# EAGLE schematic Schematic (EAGLE 6.3)
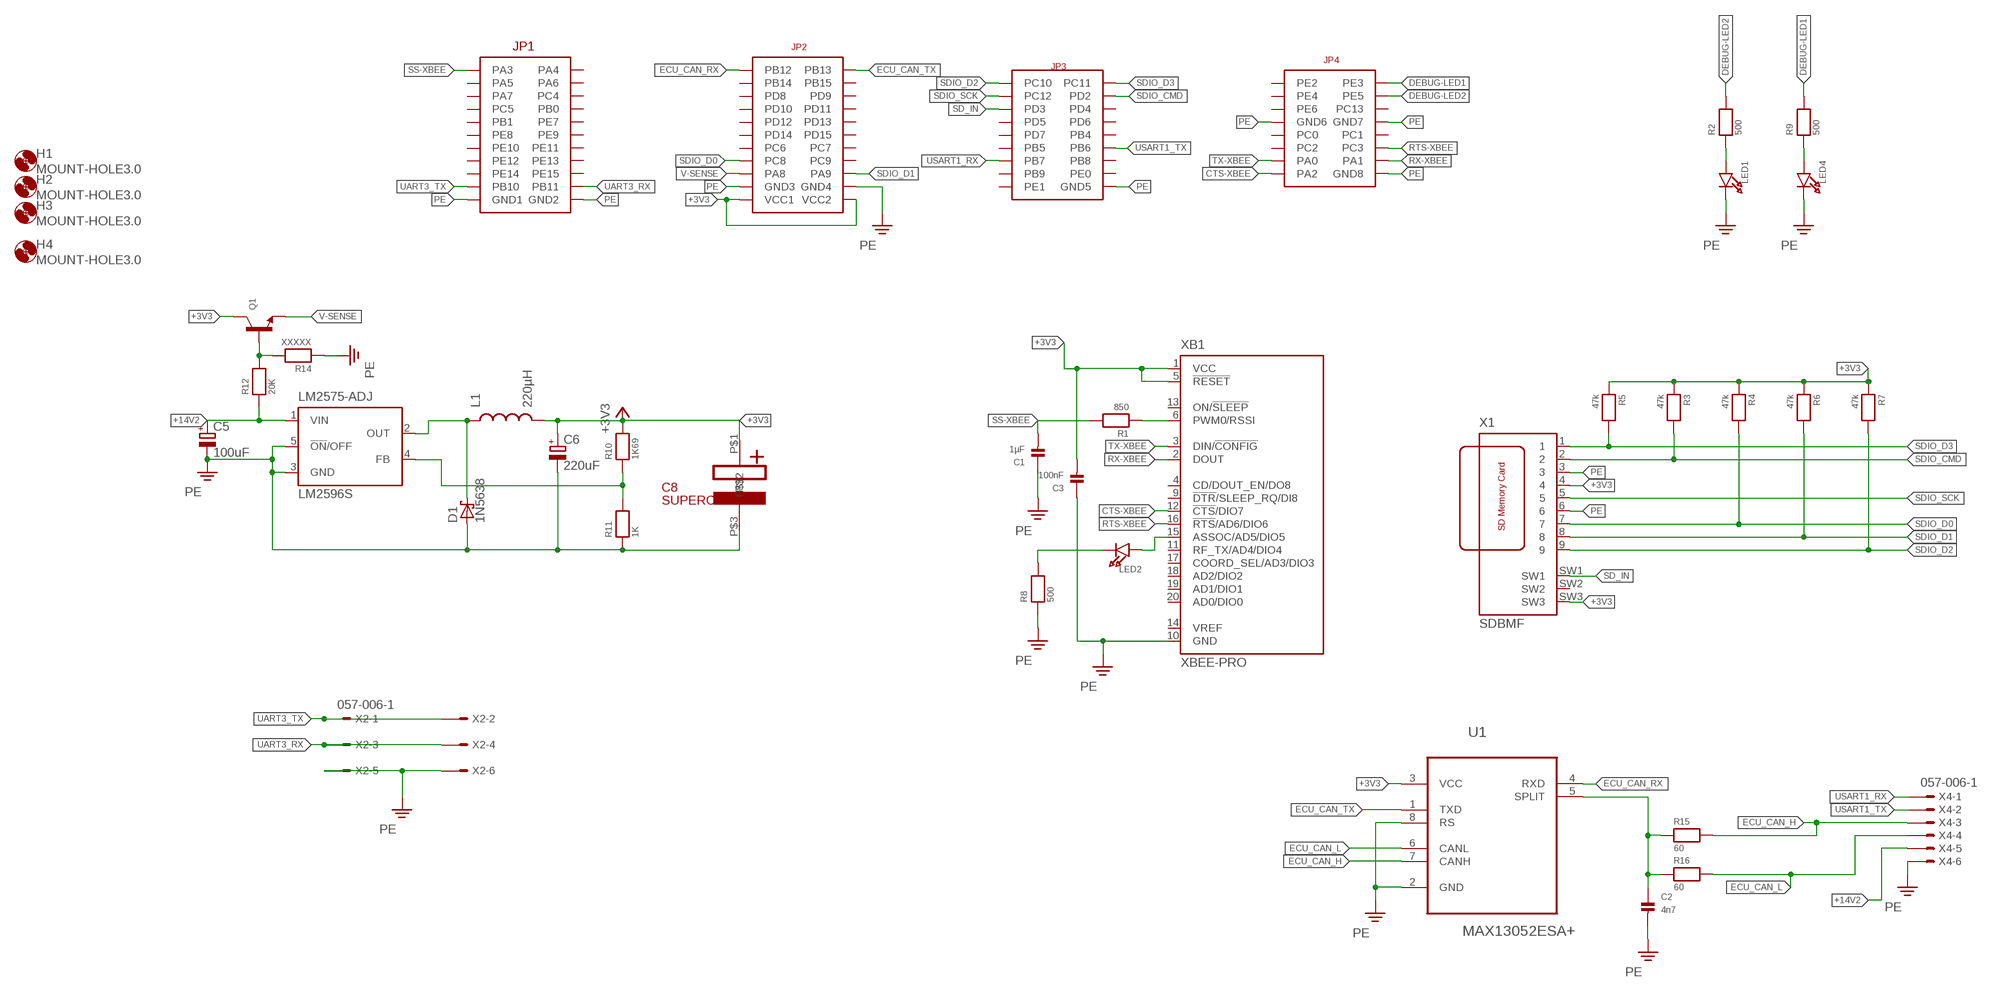
[diagram p0: schematic, sheet 1]

## Parts
C1  1µF  CAP_CERAMIC_0805  [_0805]
C2  4n7  CAP_CERAMIC0603  [0603]
C3  100nF  CAP_CERAMIC_0603  [_0603]
C5  100uF  CPOL-EUE15-5AXIAL  [E15-5]
C6  220uF  CPOL-EUE15-5AXIAL  [E15-5]
C8  SUPERCAP  [SUPERCAP]
D1  1N5638  [DO13M]
H1  MOUNT-HOLE3.0  [3,0]
H2  MOUNT-HOLE3.0  [3,0]
H3  MOUNT-HOLE3.0  [3,0]
H4  MOUNT-HOLE3.0  [3,0]
L1  220µH  INDUCTORPWR  [CDRH125]
LED1  LED1206  [CHIPLED_1206]
LED2  LED1206  [CHIPLED_1206]
LED4  LED1206  [CHIPLED_1206]
LM2575-ADJ  LM2596S  [TO263-5]
Q1  TRANSISTOR_NPNWIDE  [SOT23-WIDE]
R1  850  RESISTOR_0603  [_0603]
R2  500  RESISTOR_0603  [_0603]
R3  47k  RESISTOR_0603  [_0603]
R4  47k  RESISTOR_0603  [_0603]
R5  47k  RESISTOR_0603  [_0603]
R6  47k  RESISTOR_0603  [_0603]
R7  47k  RESISTOR_0603  [_0603]
R8  500  RESISTOR_0603  [_0603]
R9  500  RESISTOR_0603  [_0603]
R10  1K69  RESISTOR_0603  [_0603]
R11  1K  RESISTOR_0603  [_0603]
R12  20K  RESISTOR_0603  [_0603]
R14  XXXXX  RESISTOR_0603  [_0603]
R15  60  RESISTOR_0603  [_0603]
R16  60  RESISTOR_0603  [_0603]
U1  MAX13052ESA+  [SOIC127P600X175-8N]
U$1  CPU-BOARD  [CPU-BOARD-JP1]
X1  SDBMF  [SDBMF-009XXBXX2]
X2  057-006-1  [057-006-1]
X4  057-006-1  [057-006-1]
XB1  XBEE-PRO  [XBEE-PRO]

## Nets
+3V3: C3.2 C6.+ C8.P$1 L1.2 Q1.3(C) R3.1 R4.1 R5.1 R6.1 R7.1 R10.2 U1.3(VCC) U$1.P$43(VCC1) U$1.P$44(VCC2) X1.4 X1.SW3 XB1.1(VCC) XB1.5(!RESET)
+14V2: C5.+ LM2575-ADJ.1(VIN) R12.1 X4.5
CTS-XBEE: U$1.P$77(PA2) XB1.12(!CTS!/DIO7)
DEBUG-LED1: R9.2 U$1.P$64(PE3)
DEBUG-LED2: R2.2 U$1.P$66(PE5)
ECU_CAN_H: R15.2 U1.7(CANH) X4.3
ECU_CAN_L: R16.2 U1.6(CANL) X4.4
ECU_CAN_RX: U1.4(RXD) U$1.P$23(PB12)
ECU_CAN_TX: U1.1(TXD) U$1.P$24(PB13)
N$2: R1.1 XB1.6(PWM0/RSSI)
N$3: LED1.A R2.1
N$5: LED2.A XB1.15(ASSOC/AD5/DIO5)
N$6: LED2.C R8.2
N$7: LED4.A R9.1
N$10: D1.C L1.1 LM2575-ADJ.2(OUT)
N$13: LM2575-ADJ.4(FB) R10.1 R11.2
N$14: Q1.1(B) R12.2 R14.2
N$21: C2.1 R15.1 R16.1 U1.5(SPLIT)
PE: C1.1 C2.2 C3.1 C5.- C6.- C8.P$3 D1.A LED1.C LED4.C LM2575-ADJ.3(GND) LM2575-ADJ.5(!ON!/OFF) R8.1 R11.1 R14.1 U1.2(GND) U1.8(RS) U$1.P$19(GND1) U$1.P$20(GND2) U$1.P$41(GND3) U$1.P$42(GND4) U$1.P$62(GND5) U$1.P$69(GND6) U$1.P$70(GND7) U$1.P$78(GND8) X1.3 X1.6 X2.5 X2.6 X4.6 XB1.10(GND)
RTS-XBEE: U$1.P$74(PC3) XB1.16(!RTS!/AD6/DIO6)
RX-XBEE: U$1.P$76(PA1) XB1.2(DOUT)
SD_IN: U$1.P$49(PD3) X1.SW1
SDIO_CMD: R3.2 U$1.P$48(PD2) X1.2
SDIO_D0: R4.2 U$1.P$37(PC8) X1.7
SDIO_D1: R6.2 U$1.P$40(PA9) X1.8
SDIO_D2: R7.2 U$1.P$45(PC10) X1.9
SDIO_D3: R5.2 U$1.P$46(PC11) X1.1
SDIO_SCK: U$1.P$47(PC12) X1.5
SS-XBEE: C1.2 R1.2 U$1.P$1(PA3)
TX-XBEE: U$1.P$75(PA0) XB1.3(DIN/!CONFIG)
UART3_RX: U$1.P$22(PB11) X2.3 X2.4
UART3_TX: U$1.P$21(PB10) X2.1 X2.2
USART1_RX: U$1.P$57(PB7) X4.1
USART1_TX: U$1.P$56(PB6) X4.2
V-SENSE: Q1.2(E) U$1.P$39(PA8)
Unconnected: U$1.P$2(PA4) U$1.P$3(PA5) U$1.P$4(PA6) U$1.P$5(PA7) U$1.P$6(PC4) U$1.P$7(PC5) U$1.P$8(PB0) U$1.P$9(PB1) U$1.P$10(PE7) U$1.P$11(PE8) U$1.P$12(PE9) U$1.P$13(PE10) U$1.P$14(PE11) U$1.P$15(PE12) U$1.P$16(PE13) U$1.P$17(PE14) U$1.P$18(PE15) U$1.P$25(PB14) U$1.P$26(PB15) U$1.P$27(PD8) U$1.P$28(PD9) U$1.P$29(PD10) U$1.P$30(PD11) U$1.P$31(PD12) U$1.P$32(PD13) U$1.P$33(PD14) U$1.P$34(PD15) U$1.P$35(PC6) U$1.P$36(PC7) U$1.P$38(PC9) U$1.P$50(PD4) U$1.P$51(PD5) U$1.P$52(PD6) U$1.P$53(PD7) U$1.P$54(PB4) U$1.P$55(PB5) U$1.P$58(PB8) U$1.P$59(PB9) U$1.P$60(PE0) U$1.P$61(PE1) U$1.P$63(PE2) U$1.P$65(PE4) U$1.P$67(PE6) U$1.P$68(PC13) U$1.P$71(PC0) U$1.P$72(PC1) U$1.P$73(PC2) X1.SW2 XB1.4(CD/DOUT_EN/DO8) XB1.9(!DTR!/SLEEP_RQ/DI8) XB1.11(RF_TX/AD4/DIO4) XB1.13(ON/!SLEEP) XB1.14(VREF) XB1.17(COORD_SEL/AD3/DIO3) XB1.18(AD2/DIO2) XB1.19(AD1/DIO1) XB1.20(AD0/DIO0)

## Library data of the parts
C1-C3 = microbuilder:CAP_CERAMIC: Ceramic Capacitors 0402 - 0402 Surface Mount Capacitors 16pF 50V 5% [Digikey: 445-4899-2-ND] 18pF 50V 5% [Digikey: 490-1281-2-ND] 22pF 50V 5% [Digikey: 490-1283-2-ND] 68pF 50V 5% [Digikey: 490-1289-2-ND] 0.1uF 10V 10% [Digikey: 490-1318-2-ND] 1.0uF 6.3V 10% [Digikey: 490-1320-2-ND] 0603 - 0603 Surface Mount Capacitors 16 pF 50V 5% [Digikey: 445-5051-2-ND] 22 pF 50V [Digikey: PCC220ACVTR-ND] 33 pF 50V 5% [Digikey: 490-1415-1-ND] 56pF 50V 5% [Digikey: 490-1421-1-ND] 220pF 50V 5% [Digikey: 445-1285-1-ND] 680 pF 50V 2200 pF 50V 5% C0G [Digikey: 445-1297-1-ND] 5600 pF 100V 5% X7R [Digikey: 478-3711-1-ND] 0.1 µF 25V 10% [Digikey: PCC2277TR-ND] 0.22 µF 16V 10% X7R [Digikey: 445-1318-1-ND] 1.0 µF 25V 10% [Digikey: 445-5146-2-ND] 0603 - RF Specific 3pF 250V +/-0.1pF RF [Digikey: 712-1347-1-ND] 18 pF 250V 5% [Digikey: 478-3505-1-ND or 712-1322-1-ND] 56 pF 250V 5% C0G RF [Digikey: 490-4867-1-ND] 68 pF 250V RF [Digikey: 490-4868-1-ND] 0805 - 0805 Surface Mount Capacitors 220 pF 250V 2% RF Ceramic Capacitor [Digikey: 712-1398-1-ND] 1000 pF 50V 2% NP0 Ceramic Capacitor [Digikey: 478-3760-1-ND] 0.1 µF 25V 10% Ceramic Capacitor [Digikey: PCC1828TR-ND] 1.0 µF 16V 10% Ceramic Capacitor[Digikey: 490-1691-2-ND] 10.0 µF 10V 10% Ceramic Capacitor[Digikey: 709-1228-1-ND] 10.0 uF 16V 10% Ceramic Capacitor [Digikey: 478-5165-2-ND] 47 uF 6.3V 20% Ceramic Capacitor [Digikey: 587-1779-1-ND or 399-5506-1-ND] 1206 - 1206 Surface Mount Capacitors 47uF 10V 20% Ceramic Capacitor [Digikey: 490-5528-1-ND or 399-5508-1-ND or 445-6010-1-ND] 100uF 6.3V -20%, +80% Y5V Ceramic Capacitor (Digikey: 490-4512-1-ND, Mouser: 81-GRM31CF50J107ZE1L)
C5 C6 = rcl:CPOL-EU: POLARIZED CAPACITOR, European symbol
C8 = unicorn_v2:SUPERCAP
D1 = diode:1N5638: DIODE schottky
H1-H4 = holes:MOUNT-HOLE: MOUNTING HOLE with drill center marker
L1 = SparkFun-Passives:INDUCTOR: Inductors Basic Inductor/Choke - 0603 and 1206. Footprints are not proven and vary greatly between part numbers. SRN6045- 33uH, 20% 1.4A SDR0403-560KL - 56uH, 10%, 500mA RMS/740mA peak
LED1 LED2 LED4 = microbuilder:LED: LED 0603 - 0603 Surface Mount Package 2mA: Green LED - Low Power (3.9mcd, 2ma, 1.7Vf) - Digikey: 475-2709-2-ND Orange LED - Low Power (9.8mcd, 2ma, 1.8Vf) - Digikey: 475-1194-2-ND Red LED - Low Power (5mcd, 2ma, 1.8Vf) - Digikey: 475-1195-2-ND Yellow LED - Low Power (7mcd, 2ma, 1.8Vf) - Digikey: 475-1196-2-ND 5mA: Blue LED - Low Power (17mcd, 5ma, 2.9Vf) - Digikey: LNJ937W8CRACT-ND 0805 - 0805 Surface Mount Package 2mA: Red LED (8.8mcd, 2mA, 1.8Vf, Clear) - Low Power [Digikey: 475-2510-1-ND] Green LED (5mcd, 2mA, 1.8Vf, Clear) - Low Power [Digikey: 475-2730-1-ND] Yellow LED (11.3mcd, 2mA, 1.8Vf, Clear) - Low Power [Digikey: 475-2555-1-ND] 20mA: Red LED (104mcd, 20mA, Diffused) - LS R976 [Digikey: 475-1278-6-ND] Red LED (12mcd, 20mA, 2.0Vf, Clear) - APT2012EC [Digikey: 754-1128-1-ND] Green LED (15mcd, 20mA, 2.2Vf, Clear) - APT2012GC [Digikey: 754-1131-1-ND] Orange LED (160mcd, 20mA, 2.1Vf, Clear) - APT2012SECK [Digikey: 754-1130-1-ND] 1206 - 1206 Surface Mount Package Green LED (26mcd, 20mA, Diffused) - LG N971 [Digikey: 475-1407-6-ND] Red LED (15mcd, 20mA, Diffused) - LH N974 [Digikey: 475-1416-6-ND]
LM2575-ADJ = national-semiconductor:LM2596: SIMPLE SWITCHER® Power Converter 150 kHz 3A Step-Down Voltage Regulator Source: http://www.national.com/ds/LM/LM2596.pdf; MF: NATIONAL SEMICONDUCTOR; MPN: LM2596S-ADJ/NOPB; OC_FARNELL: 9494367; OC_NEWARK: 41K3842
Q1 = microbuilder:TRANSISTOR_NPN: NPN Transistor Transistor (NPN) 500mA 45V - BC817 [Digikey: 568-1631-1-ND] Transistor (NPN) 500mA 45V - BC817,215 [Mouser: 771-BC817-T/R] SOT23-R - SOT23 footprint optimised for use with solder paste and reflow ovens. SOT23-W - SOT23 footprint optimised for hand-soldering (larger pads).
R1-R12 R14-R16 = microbuilder:RESISTOR: Resistors 0402 - 0402 Surface Mount Package 22 Ohm 1% 1/16W [Digikey: 311-22.0LRTR-ND] 33 Ohm 5% 1/16W 1.0K 5% 1/16W 1.5K 5% 1/16W 2.0K 1% 1/16W 10.0K 1% 1/16W [Digikey: 311-10.0KLRTR-ND] 10.0K 5% 1/16W [Digikey: RMCF0402JT10K0TR-ND] 12.1K 1% 1/16W [Digikey: 311-22.0LRTR-ND] 100.0K 5% 1/16W 0603 - 0603 Surface Mount Package 0 Ohm 1/10 Watt 1% Resistor 15 Ohm 1/10 Watt 1% Resistor 33 Ohm 1/10 Watt 1% Resistor 49.9 Ohm 1/10 Watt 1% Resistor 100 Ohm 1/10 Watt 1% Resistor 150 Ohm 1/10 Watt 1% Resistor 240 Ohm 1/10 Watt 1% Resistor 390 Ohm 1/10 Watt 1% Resistor 560 Ohm 1/10 Watt 1% Resistor 680 Ohm 1/10 Watt 1% Resistor 750 Ohm 1/10 Watt 1% Resistor 1.0K Ohm 1/10 Watt 1% Resistor 1.5K Ohm 1/10 Watt 1% Resistor 2.0K Ohm 1/10 Watt 1% Resistor 2.2K Ohm 1/10 Watt 1% Resistor 3.3K Ohm 1/10 Watt 1% Resistor 4.7K Ohm 1/10 Watt 1% Resistor 10.0K Ohm 1/10 Watt 1% Resistor 12.0K Ohm 1/10 Watt 1% Resistor 12.1K Ohm 1/10 Watt 1% Resistor 20.0K Ohm 1/10 Watt 1% Resistor 33.0K Ohm 1/10 Watt 1% Resistor 100.0K Ohm 1/10 Watt 1% Resistor 0805 - 0805 Surface Mount Package 0 Ohm 1/8 Watt 1% Resistor 33 Ohm 1/8 Watt 1% Resistor 100 Ohm 1/8 Watt 1% Resistor 150 Ohm 1/8 Watt 1% Resistor 200 Ohm 1/8 Watt 1% Resistor 240 Ohm 1/8 Watt 1% Resistor 330 Ohm 1/8 Watt 1% Resistor 390 Ohm 1/8 Watt 1% Resistor 470 Ohm 1/8 Watt 1% Resistor 1.0K Ohm 1/8 Watt 1% Resistor 1.5K Ohm 1/8 Watt 1% Resistor 2.0K Ohm 1/8 Watt 1% Resistor 4.7K Ohm 1/8 Watt 1% Resistor 5.1K Ohm 1/8 Watt 1% Resistor 5.6K Ohm 1/8 Watt 1% Resistor 10.0K Ohm 1/8 Watt 1% Resistor 22.0K Ohm 1/8 Watt 1% Resistor 33.0K Ohm 1/8 Watt 1% Resistor 100K Ohm 1/8 Watt 1% Resistor 1206 - 1206 Surface Mount Package 2012 - 2010 Surface Mount Package 0.11 Ohm 1/2 Watt 1% Resistor - Digikey: RHM.11UCT-ND
U1 = Maxim_By_element14_Batch_1:MAX13052ESA+: Industry-Standard High-Speed CAN Transceivers with ±80V Fault Protection; MPN: MAX13052ESA+; OC_FARNELL: 1600112; OC_NEWARK: 99K2875; PACKAGE: SOIC-8; SUPPLIER: Maxim
U$1 = unicorn_v2:CPU-BOARD
X1 = farnell:SDBMF: SD MEMORY CARD PUSH-PUSH WITH CONNECTOR TYPE B (BIG SWUÌTCH #3) KINGFONT PRECISION INDUSTIAL CO., LTD Source: http://www.farnell.com/datasheets/74273.pdf Best.-Nr.: 9186174 Hersteller: MULTICOMP Herstellerbez.: SDBMF-00915B0T2
X2 X4 = con-panduit:057-006-: CONNECTOR 6-pin series 057 contact pc board low profile headers; OC_FARNELL: unknown; OC_NEWARK: unknown
XB1 = maxstream:XBEE: XBee (TM) /XBee-PRO(TM) OEM RF Modules Source: MaxStream, Inc. xbee_productmanual.pdf; MPN: XBP24-AWI-001; OC_FARNELL: 1337916; OC_NEWARK: 42M2667